# Altium schematic sheet [04] - Mechanicals and Connectors.SchDoc
size A3; DrawnBy: JW; DocumentNumber: 3; SheetNumber: 3; SheetTotal: 3
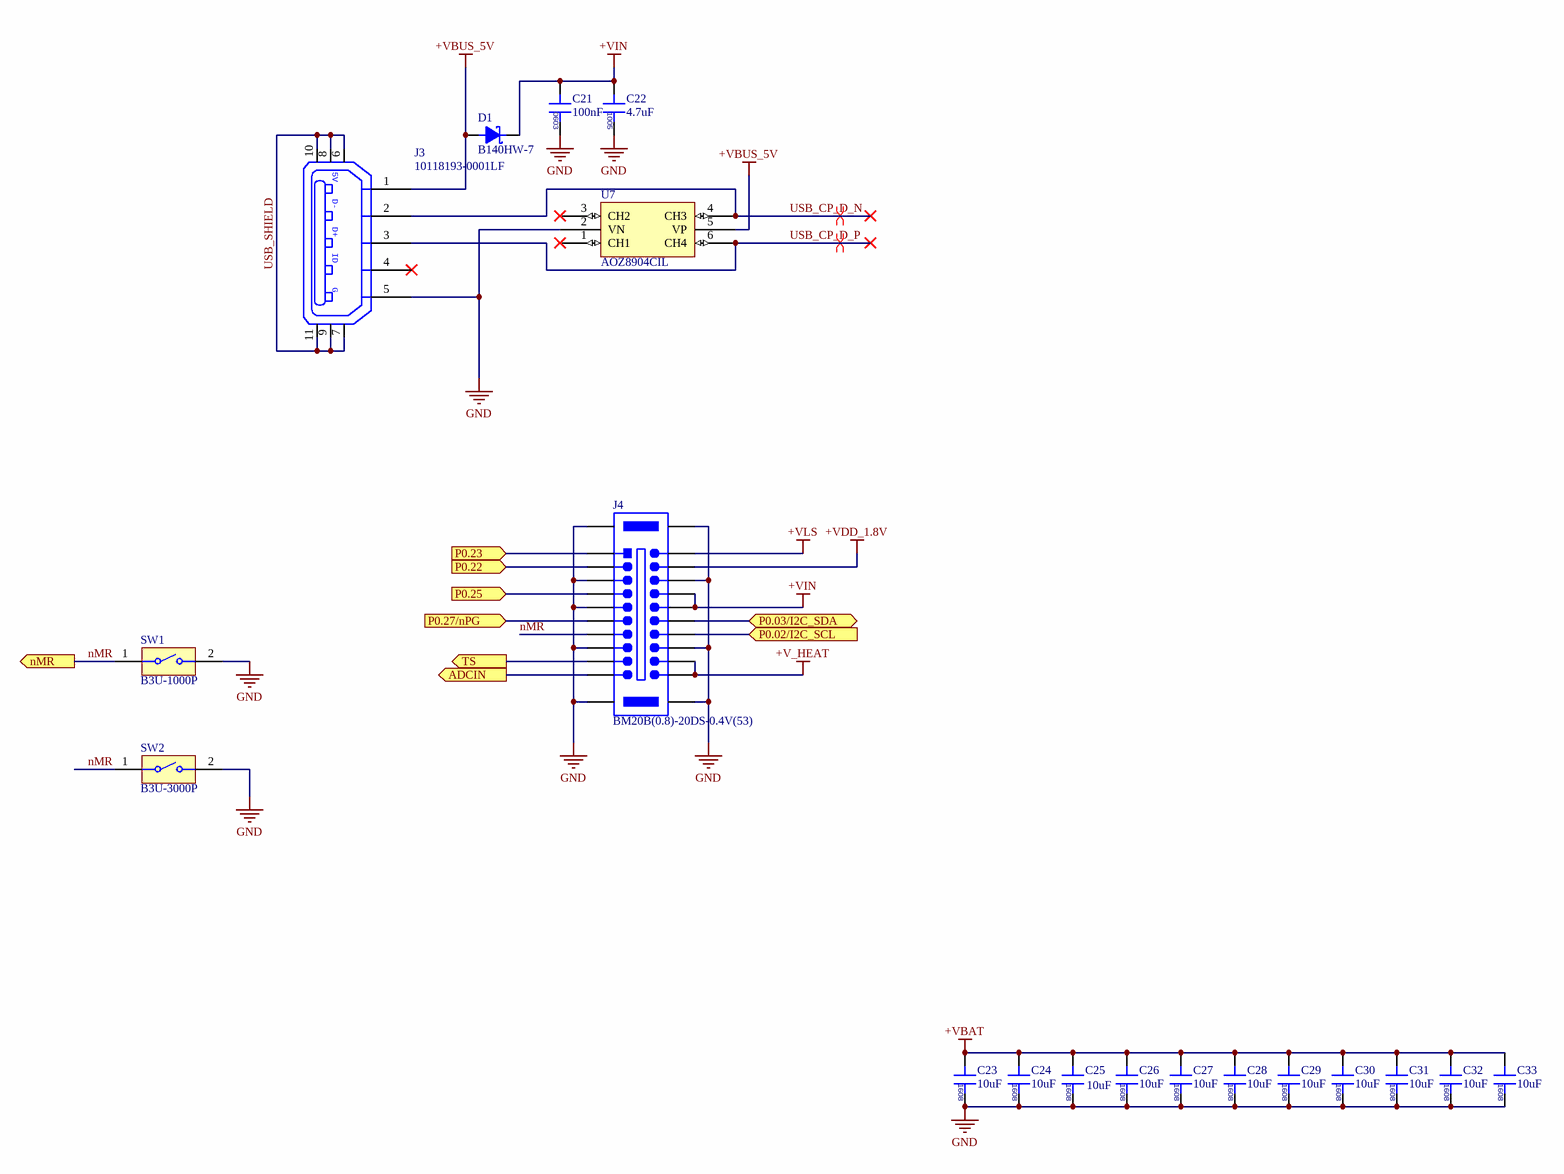
[diagram p0: [04] - Mechanicals and Connectors.SchDoc]

## Parts
C21  100nF  [CAPC0603X03N]
C22  4.7uF  [CAPC1005X06N]
C23  10uF  [CAPC1608X08N]
C24  10uF  [CAPC1608X08N]
C25  10uF  [CAPC1608X08N]
C26  10uF  [CAPC1608X08N]
C27  10uF  [CAPC1608X08N]
C28  10uF  [CAPC1608X08N]
C29  10uF  [CAPC1608X08N]
C30  10uF  [CAPC1608X08N]
C31  10uF  [CAPC1608X08N]
C32  10uF  [CAPC1608X08N]
C33  10uF  [CAPC1608X08N]
D1  B140HW-7  [SOD-123]
J3  10118193-0001LF  [10118193]
J4  BM20B(0.8)-20DS-0.4V(53)  [BM20B(0.8)-20DS-0.4V(53)]
SW1  B3U-1000P  [B3U-1000P]
SW2  B3U-3000P  [B3U-3000P]
U7  AOZ8904CIL  [SOT95P280X145-6N]

## Ports
ADCIN (out), nMR (out), P0.02/I2C_SCL (in), P0.03/I2C_SDA (bidir), P0.22 (in), P0.23 (in), P0.25 (in), P0.27/nPG (in), TS (out)

## Nets
+V_HEAT: J4.18 J4.20
+VBAT: C23.2 C24.2 C25.2 C26.2 C27.2 C28.2 C29.2 C30.2 C31.2 C32.2 C33.2
+VBUS_5V: D1.2(Anode) J3.1(P1) U7.5(VP)
+VDD_1.8V: J4.4
+VIN: C21.2 C22.2 D1.1(Cathode) J4.8 J4.10
+VLS: J4.2
GND: C21.1 C22.1 C23.1 C24.1 C25.1 C26.1 C27.1 C28.1 C29.1 C30.1 C31.1 C32.1 C33.1 J3.5(P5) J4.5 J4.6 J4.9 J4.15 J4.16 J4.SH1 J4.SH2 J4.SH3 J4.SH4 SW1.2 SW2.2 U7.2(VN)
ADCIN: J4.19 ; port ADCIN
nMR: J4.13 SW1.1 SW2.1 ; port nMR
P0.02/I2C_SCL: J4.14 ; port P0.02/I2C_SCL
P0.03/I2C_SDA: J4.12 ; port P0.03/I2C_SDA
P0.22: J4.3 ; port P0.22
P0.23: J4.1 ; port P0.23
P0.25: J4.7 ; port P0.25
P0.27/nPG: J4.11 ; port P0.27/nPG
TS: J4.17 ; port TS
USB_CP_D_N: J3.2(P2) U7.4(CH3)
USB_CP_D_P: J3.3(P3) U7.6(CH4)
USB_SHIELD: J3.6 J3.7 J3.8 J3.9 J3.10 J3.11

Not connected (* = marked no-connect by the designer): J3 4(P4)*; U7 1(CH1)* 3(CH2)*

## Layout directives
differential pair; net class DIFF90: USB_CP_D_N, USB_CP_D_P

## Notes on the sheet
- Project Title:
- Number:
- Date:
- Sheet Title:
- Drawn By:
- Sheet:
- Variant:
- of
- Checked By:
- Rev:
- Size:
- keepin
- Contact:
- (in symbol 10118193-0001LF) 5V; D-; D+; ID; G

## Library data of the parts
C21 = GRM033C71C104ME14D: CAP CER 0.1UF 16V X7S 0201; Manufacturer: Murata; Tolerance: 20%; Supplier 1: Digi-Key; Supplier Part Number 1: 490-10388-1-ND; Manufacturer Part Number: GRM033C71C104ME14D; RoHS: Yes; Category: Ceramic Capacitors; Stock 1: 1023970; Pricing 1: 1=0.10000, 10=0.05100, 50=0.02780, 100=0.02260, 500=0.01616, 1000=0.01270, 2500=0.01155, 5000=0.01063 (USD); Mount: Surface Mount; Case/Package: 0201; Case Code (Metric): 0603; Case Code (Imperial): 0201; Weight: 1.2E-05oz; Min Operating Temperature: -55°C; Max Operating Temperature: 125°C; Capacitance: 100nF; Packaging: Tape and Reel; Voltage Rating: 16V; Dielectric: X7S; Termination: SMD/SMT; Voltage Rating (DC): 16V; Package Quantity: 15000; Length: 0.024inch; Width: 0.012inch; Height: 0.3mm; Thickness: 0.013inch; RoHS Compliant: Yes; ComponentLink1URL: http://www.mouser.com/ds/2/281/c02e-2905.pdf?src-supplier=Mouser; ComponentLink1Description: http://www.mouser.com/ds/2/281/c02e-2905.pdf?src-supplier=Mouser; ComponentLink2URL: http://search.murata.co.jp/Ceramy/image/img/A01X/G101/ENG/GRM033C71C104ME14-01.pdf?src-supplier=Digi-Key; ComponentLink2Description: http://search.murata.co.jp/Ceramy/image/img/A01X/G101/ENG/GRM033C71C104ME14-01.pdf?src-supplier=Digi-Key
C22 = CL05A475MO5NUNC: CAP CER 4.7UF 16V X5R 0402; Manufacturer 1: Samsung; Tolerance: 20%; Category 1: Capacitors; Category 2: Ceramic Capacitors; Supplier 1: Digi-Key; Manufacturer Part Number 1: CL05A475MO5NUNC; Stock 1: 1960205; Pricing 1: 1=0.45000, 10=0.32100, 100=0.21130, 500=0.15656, 1000=0.13307, 2500=0.12524, 5000=0.11741 (USD); RoHS: Yes; Mount: Surface Mount; Case/Package: 0402; Case Code (Imperial): 0402; Case Code (Metric): 1005; Min Operating Temperature: -55°C; Max Operating Temperature: 85°C; Packaging: Tape and Reel; Capacitance: 4.7uF; Voltage Rating: 16V; Length: 0.039inch; Width: 0.02inch; Thickness: 0.022inch; ComponentLink1URL: http://www.farnell.com/datasheets/2710653.pdf?src-supplier=Farnell; ComponentLink1Description: http://www.farnell.com/datasheets/2710653.pdf?src-supplier=Farnell; ComponentLink2URL: http://www.samsungsem.com/kr/support/product-search/mlcc/CL05A475MO5NUNC.jsp?src-supplier=Digi-Key; ComponentLink2Description: http://www.samsungsem.com/kr/support/product-search/mlcc/CL05A475MO5NUNC.jsp?src-supplier=Digi-Key; ComponentLink3URL: http://www.farnell.com/datasheets/2710653.pdf?src-supplier=Newark; ComponentLink3Description: http://www.farnell.com/datasheets/2710653.pdf?src-supplier=Newark; Supplier Part Number 1: 1276-6836-1-ND; Manufacturer: Samsung; Manufacturer Part Number: CL05A475MO5NUNC
C23-C33 = CL10X106MO8NRNC: CAP CER 10UF 16V X6S 0603; Manufacturer: Samsung; Tolerance: 20%; Supplier 1: Digi-Key; Supplier Part Number 1: 1276-6769-1-ND; Manufacturer Part Number: CL10X106MO8NRNC; RoHS: Yes; Category: Ceramic Capacitors; Stock 1: 508506; Pricing 1: 1=0.30000, 10=0.20600, 50=0.12360, 100=0.10430, 500=0.07136, 1000=0.06312 (USD); Mount: Surface Mount; Case/Package: 0603; Case Code (Imperial): 0603; Case Code (Metric): 1608; Min Operating Temperature: -55°C; Max Operating Temperature: 105°C; Packaging: Tape and Reel; Capacitance: 10uF; Voltage Rating: 16V; Length: 0.063inch; Width: 0.031inch; Thickness: 0.035inch; ComponentLink1URL: http://www.samsungsem.com/kr/support/product-search/mlcc/CL10X106MO8NRNC.jsp?src-supplier=Digi-Key; ComponentLink1Description: http://www.samsungsem.com/kr/support/product-search/mlcc/CL10X106MO8NRNC.jsp?src-supplier=Digi-Key
D1 = B140HW-7: Diode Schottky 40V 1A 2Pin SOD123; Manufacturer: Diodes; Max Reverse Current: 40uA; Peak Non-Repetitive Surge Current: 16A; Element Configuration: Single; Forward Voltage: 550mV; Max Power Dissipation: 410mW; Polarity: Standard; Supplier 1: Digi-Key; Supplier Part Number 1: B140HWDICT-ND; Manufacturer Part Number: B140HW-7; RoHS: Yes; Category: Rectifier Diodes; Stock 1: 132539; Pricing 1: 1=0.43000, 10=0.28300, 100=0.14140, 500=0.10504, 1000=0.07676 (USD); Mount: Surface Mount; Number of Pins: 2; Weight: 0.000353oz; Contact Plating: Tin,Matte; Min Operating Temperature: -65°C; Max Operating Temperature: 125°C; Forward Current: 1A; Max Repetitive Reverse Voltage (Vrrm): 40V; Package Quantity: 3000; Packaging: Tape and Reel; Average Rectified Current: 1A; Max Forward Surge Current (Ifsm): 16A; Voltage Rating (DC): 40V; Current Rating: 1A; Output Current: 1A; Max Reverse Voltage (DC): 40V; Length: 2.85mm; Width: 1.7mm; Height: 1.25mm; Radiation Hardening: No; REACH SVHC: No SVHC; Lead Free: Lead Free; ComponentLink1URL: https://datasheet.ciiva.com/4715/ds30670-86720-4715619.pdf?src-supplier=Mouser; ComponentLink1Description: https://datasheet.ciiva.com/4715/ds30670-86720-4715619.pdf?src-supplier=Mouser; ComponentLink2URL: https://datasheet.ciiva.com/25946/ds30670-25946913.pdf?src-supplier=Avnet+Europe; ComponentLink2Description: https://datasheet.ciiva.com/25946/ds30670-25946913.pdf?src-supplier=Avnet+Europe; ComponentLink3URL: https://datasheet.ciiva.com/26788/b140hw-7-26788582.pdf?src-supplier=IIIC; ComponentLink3Description: https://datasheet.ciiva.com/26788/b140hw-7-26788582.pdf?src-supplier=IIIC; ComponentLink4URL: https://datasheet.ciiva.com/912/ds30670-912807.pdf?src-supplier=Digi-Key; ComponentLink4Description: https://datasheet.ciiva.com/912/ds30670-912807.pdf?src-supplier=Digi-Key; ComponentLink5URL: https://datasheet.ciiva.com/1177/ds30670-1177415.pdf?src-supplier=Element14; ComponentLink5Description: https://datasheet.ciiva.com/1177/ds30670-1177415.pdf?src-supplier=Element14; ComponentLink6URL: https://datasheet.ciiva.com/8303/ds30670-8303271.pdf?src-supplier=Avnet; ComponentLink6Description: https://datasheet.ciiva.com/8303/ds30670-8303271.pdf?src-supplier=Avnet; ComponentLink7URL: https://datasheet.ciiva.com/912/ds30670-912808.pdf?src-supplier=Digi-Key; ComponentLink7Description: https://datasheet.ciiva.com/912/ds30670-912808.pdf?src-supplier=Digi-Key; ComponentLink8URL: https://datasheet.ciiva.com/912/ds30670-912809.pdf?src-supplier=Digi-Key; ComponentLink8Description: https://datasheet.ciiva.com/912/ds30670-912809.pdf?src-supplier=Digi-Key; ComponentLink9URL: https://datasheet.ciiva.com/8301/ds30670-8301643.pdf?src-supplier=Avnet; ComponentLink9Description: https://datasheet.ciiva.com/8301/ds30670-8301643.pdf?src-supplier=Avnet; ComponentLink10URL: https://datasheet.ciiva.com/15220/getdatasheetpartid-245799-15220198.pdf?src-supplier=Verical; ComponentLink10Description: https://datasheet.ciiva.com/15220/getdatasheetpartid-245799-15220198.pdf?src-supplier=Verical
J3 = 10118193-0001LF: CONN USB MICRO B RECPT SMT R/A; Manufacturer: FCI; Category 1: Connectors, Interconnects; Connector Type: USB - micro B; Number of Contacts: 5; Gender: Receptacle; Specifications: USB 2.0; Category 2: USB, DVI, HDMI Connectors; Supplier 1: Digi-Key; Manufacturer Part Number: 10118193-0001LF; RoHS: RoHS Compliant; Stock 1: 28642; Pricing 1: 1=0.46, 10=0.433, 25=0.3712, 50=0.3156, 100=0.3032, 250=0.27224, 500=0.25988 (USD); Packaging: Cut Tape (CT); Mounting Type: Surface Mount, Right Angle, Horizontal; Features: Shielded, Solder Retention; Ingress Protection: -; ComponentLink1URL: http://portal.fciconnect.com/Comergent//fci/drawing/10118193.pdf; ComponentLink1Description: http://portal.fciconnect.com/Comergent//fci/drawing/10118193.pdf; Supplier Part Number 1: 609-4616-1-ND; Mount: Surface Mount
J4 = BM20B(0.8)-20DS-0.4V(53): CONN RCPT 20POS 0.4MM SMD; Manufacturer: Hirose; Voltage Rating: 30V; Current Rating: 300mA; Number of Positions: 20; Insulation Resistance: 50MR; Connector Type: Receptacle; Pitch: 0.016inch; Stack Height: 0.8mm; Supplier 1: Digi-Key; Supplier Part Number 1: H122165CT-ND; Manufacturer Part Number: BM20B(0.8)-20DS-0.4V(53); RoHS: Yes; Category: Headers and Wire Housings; Stock 1: 775; Pricing 1: 1=1.22000, 10=1.07100, 25=1.00800, 50=0.96600, 100=0.92400, 250=0.84000, 500=0.75600 (USD); Mount: Surface Mount; Contact Plating: Gold; Housing Material: Polymer; Min Operating Temperature: -35°C; Max Operating Temperature: 85°C; Number of Rows: 2; Packaging: Tape and Reel; Package Quantity: 1000; Termination: SMD/SMT; Mated Stacking Heights: 0.8mm; RoHS Compliant: Yes; ComponentLink1URL: https://datasheet.ciiva.com/29164/en-bm20-20130409-29164358.pdf?src-supplier=Digi-Key; ComponentLink1Description: https://datasheet.ciiva.com/29164/en-bm20-20130409-29164358.pdf?src-supplier=Digi-Key
SW1 = B3U-1000P: SWITCH TACTILE SPST-NO 0.05A 12V; Manufacturer: Omron; Mechanical Life: 200000Cycles; Operating Force: 1.5N; Throw Configuration: SPST; Current Rating: 50mA; Contact Resistance: 100mR; Illumination Type: Non-Illuminated,Illuminated; Switch Travel: 0.15mm; Switch Function: Off-Mom; Actuator Type: Standard; Actuator Length: 0.4mm; Ratings: Dust Proof,IP40; Supplier 1: Digi-Key; Supplier Part Number 1: SW1020CT-ND; Manufacturer Part Number: B3U-1000P; RoHS: Yes; Category: Tactile Switches; Stock 1: 18757; Pricing 1: 1=0.96000, 10=0.92700, 25=0.86640, 100=0.75220, 250=0.68448, 500=0.63456, 1000=0.62388 (USD); Mount: Surface Mount; Weight: 0.000776oz; Contact Material: Silver; Min Operating Temperature: -25°C; Max Operating Temperature: 70°C; Packaging: Tape and Reel; Voltage Rating (DC): 12V; Package Quantity: 1; Series: B3U; Max Current Rating: 50mA; Termination: SMD/SMT; Orientation: Straight; Max Voltage Rating (DC): 12V; Electrical Life: 200000Cycles; Insulation Resistance: 100MR; Contact Current Rating: 50mA; Length: 4mm; Width: 3mm; Height: 1.2mm; Depth: 2.5mm; RoHS Compliant: Yes; REACH SVHC: Unknown; Lead Free: Lead Free; ComponentLink1URL: https://datasheet.ciiva.com/22696/1685550-22696214.pdf?src-supplier=Element14; ComponentLink1Description: https://datasheet.ciiva.com/22696/1685550-22696214.pdf?src-supplier=Element14; ComponentLink2URL: https://datasheet.ciiva.com/26917/getdatasheetpartid-552554-26917552.pdf?src-supplier=Verical; ComponentLink2Description: https://datasheet.ciiva.com/26917/getdatasheetpartid-552554-26917552.pdf?src-supplier=Verical; ComponentLink3URL: https://datasheet.ciiva.com/1532/1685550-1532680.pdf?src-supplier=Element14; ComponentLink3Description: https://datasheet.ciiva.com/1532/1685550-1532680.pdf?src-supplier=Element14; ComponentLink4URL: https://datasheet.ciiva.com/1634/1685550-1634396.pdf?src-supplier=Farnell; ComponentLink4Description: https://datasheet.ciiva.com/1634/1685550-1634396.pdf?src-supplier=Farnell; ComponentLink5URL: https://datasheet.ciiva.com/14142/b3u-eng-datasheet-14142540.pdf?src-supplier=Distrelec; ComponentLink5Description: https://datasheet.ciiva.com/14142/b3u-eng-datasheet-14142540.pdf?src-supplier=Distrelec; ComponentLink6URL: https://datasheet.ciiva.com/16862/70176037-16862846.pdf?src-supplier=Allied+Electronics; ComponentLink6Description: https://datasheet.ciiva.com/16862/70176037-16862846.pdf?src-supplier=Allied+Electronics; ComponentLink7URL: https://datasheet.ciiva.com/16155/en-b3u-16155021.pdf?src-supplier=Onlinecomponents.com; ComponentLink7Description: https://datasheet.ciiva.com/16155/en-b3u-16155021.pdf?src-supplier=Onlinecomponents.com; ComponentLink8URL: https://datasheet.ciiva.com/2900/b3u-1110-2900030.pdf?src-supplier=Digi-Key; ComponentLink8Description: https://datasheet.ciiva.com/2900/b3u-1110-2900030.pdf?src-supplier=Digi-Key; ComponentLink9URL: https://datasheet.ciiva.com/2900/b3u-1110-2900031.pdf?src-supplier=Digi-Key; ComponentLink9Description: https://datasheet.ciiva.com/2900/b3u-1110-2900031.pdf?src-supplier=Digi-Key; ComponentLink10URL: https://datasheet.ciiva.com/2900/b3u-1110-2900029.pdf?src-supplier=Digi-Key; ComponentLink10Description: https://datasheet.ciiva.com/2900/b3u-1110-2900029.pdf?src-supplier=Digi-Key
SW2 = B3U-3000P: SWITCH TACTILE SPST-NO 0.05A 12V; Manufacturer: Omron; Mechanical Life: 100000Cycles; Operating Force: 1.59N; Contact Resistance: 100mR; Throw Configuration: SPST; Current Rating: 50mA; Illumination Type: Non-Illuminated,Illuminated; Switch Travel: 0.2mm; Switch Function: Off-Mom; Actuator Length: 0.7mm; Ratings: Dust Proof,IP40; Supplier 1: Digi-Key; Supplier Part Number 1: SW1022CT-ND; Manufacturer Part Number: B3U-3000P; RoHS: Yes; Category: Tactile Switches; Stock 1: 19962; Pricing 1: 1=0.96000, 10=0.92700, 25=0.86640, 100=0.75220, 250=0.68448, 500=0.63456, 1000=0.62388 (USD); Mount: Surface Mount; Weight: 0.022g; Contact Material: Silver; Min Operating Temperature: -25°C; Max Operating Temperature: 70°C; Packaging: Tape and Reel; Voltage Rating (DC): 12V; Package Quantity: 1; Max Voltage Rating (DC): 12V; Termination: SMD/SMT; Electrical Life: 100000Cycles; Orientation: Right Angle; Series: B3U; Max Current Rating: 50mA; Contact Current Rating: 50mA; Insulation Resistance: 100MR; Length: 4mm; Depth: 3.2mm; REACH SVHC: Unknown; Lead Free: Lead Free; ComponentLink1URL: https://datasheet.ciiva.com/1634/60838-1634400.pdf?src-supplier=Farnell; ComponentLink1Description: https://datasheet.ciiva.com/1634/60838-1634400.pdf?src-supplier=Farnell; ComponentLink2URL: https://datasheet.ciiva.com/2900/b3u-1110-2900035.pdf?src-supplier=Digi-Key; ComponentLink2Description: https://datasheet.ciiva.com/2900/b3u-1110-2900035.pdf?src-supplier=Digi-Key; ComponentLink3URL: https://datasheet.ciiva.com/2900/b3u-1110-2900036.pdf?src-supplier=Digi-Key; ComponentLink3Description: https://datasheet.ciiva.com/2900/b3u-1110-2900036.pdf?src-supplier=Digi-Key; ComponentLink4URL: https://datasheet.ciiva.com/2900/b3u-1110-2900037.pdf?src-supplier=Digi-Key; ComponentLink4Description: https://datasheet.ciiva.com/2900/b3u-1110-2900037.pdf?src-supplier=Digi-Key; ComponentLink5URL: https://datasheet.ciiva.com/30158/en-b3u-30158606.pdf?src-supplier=Onlinecomponents.com; ComponentLink5Description: https://datasheet.ciiva.com/30158/en-b3u-30158606.pdf?src-supplier=Onlinecomponents.com; ComponentLink6URL: https://datasheet.ciiva.com/1532/60838-1532682.pdf?src-supplier=Element14; ComponentLink6Description: https://datasheet.ciiva.com/1532/60838-1532682.pdf?src-supplier=Element14; ComponentLink7URL: https://datasheet.ciiva.com/16863/70176037-16863994.pdf?src-supplier=Allied+Electronics; ComponentLink7Description: https://datasheet.ciiva.com/16863/70176037-16863994.pdf?src-supplier=Allied+Electronics; ComponentLink8URL: https://datasheet.ciiva.com/14142/b3u-eng-datasheet-14142542.pdf?src-supplier=Distrelec; ComponentLink8Description: https://datasheet.ciiva.com/14142/b3u-eng-datasheet-14142542.pdf?src-supplier=Distrelec
U7 = AOZ8904CIL: TVS DIODE 5.5VWM 18VC SOT23-6; Manufacturer: Alpha & Omega Semiconductor; Direction: Unidirectional; Number of Bidirectional Channels: 4; Reverse Standoff Voltage: 5.5V; Min Breakdown Voltage: 6.6V; Clamping Voltage: 18V; Peak Pulse Power: 50W; Power Line Protection: Yes; Leakage Current: 1uA; Peak Pulse Current: 4A; Supplier 1: Digi-Key; Supplier Part Number 1: 785-1755-1-ND; Manufacturer Part Number: AOZ8904CIL; RoHS: Yes; Category: TVS Diodes; Stock 1: 249598; Pricing 1: 1=0.52000, 10=0.38700, 100=0.21930, 500=0.14520, 1000=0.11132 (USD); Mount: Surface Mount; Case/Package: SOT-23-6; Number of Pins: 6; Min Operating Temperature: -40°C; Max Operating Temperature: 125°C; Packaging: Tape and Reel; Package Quantity: 6000; Working Voltage: 5.5V; Series: -; Length: 2.9mm; Depth: 1.6mm; Radiation Hardening: No; RoHS Compliant: Yes; ComponentLink1URL: https://datasheet.ciiva.com/6575/aoz8904cil-6575149.pdf?src-supplier=Digi-Key; ComponentLink1Description: https://datasheet.ciiva.com/6575/aoz8904cil-6575149.pdf?src-supplier=Digi-Key